# Altium project STM32.PrjPcb
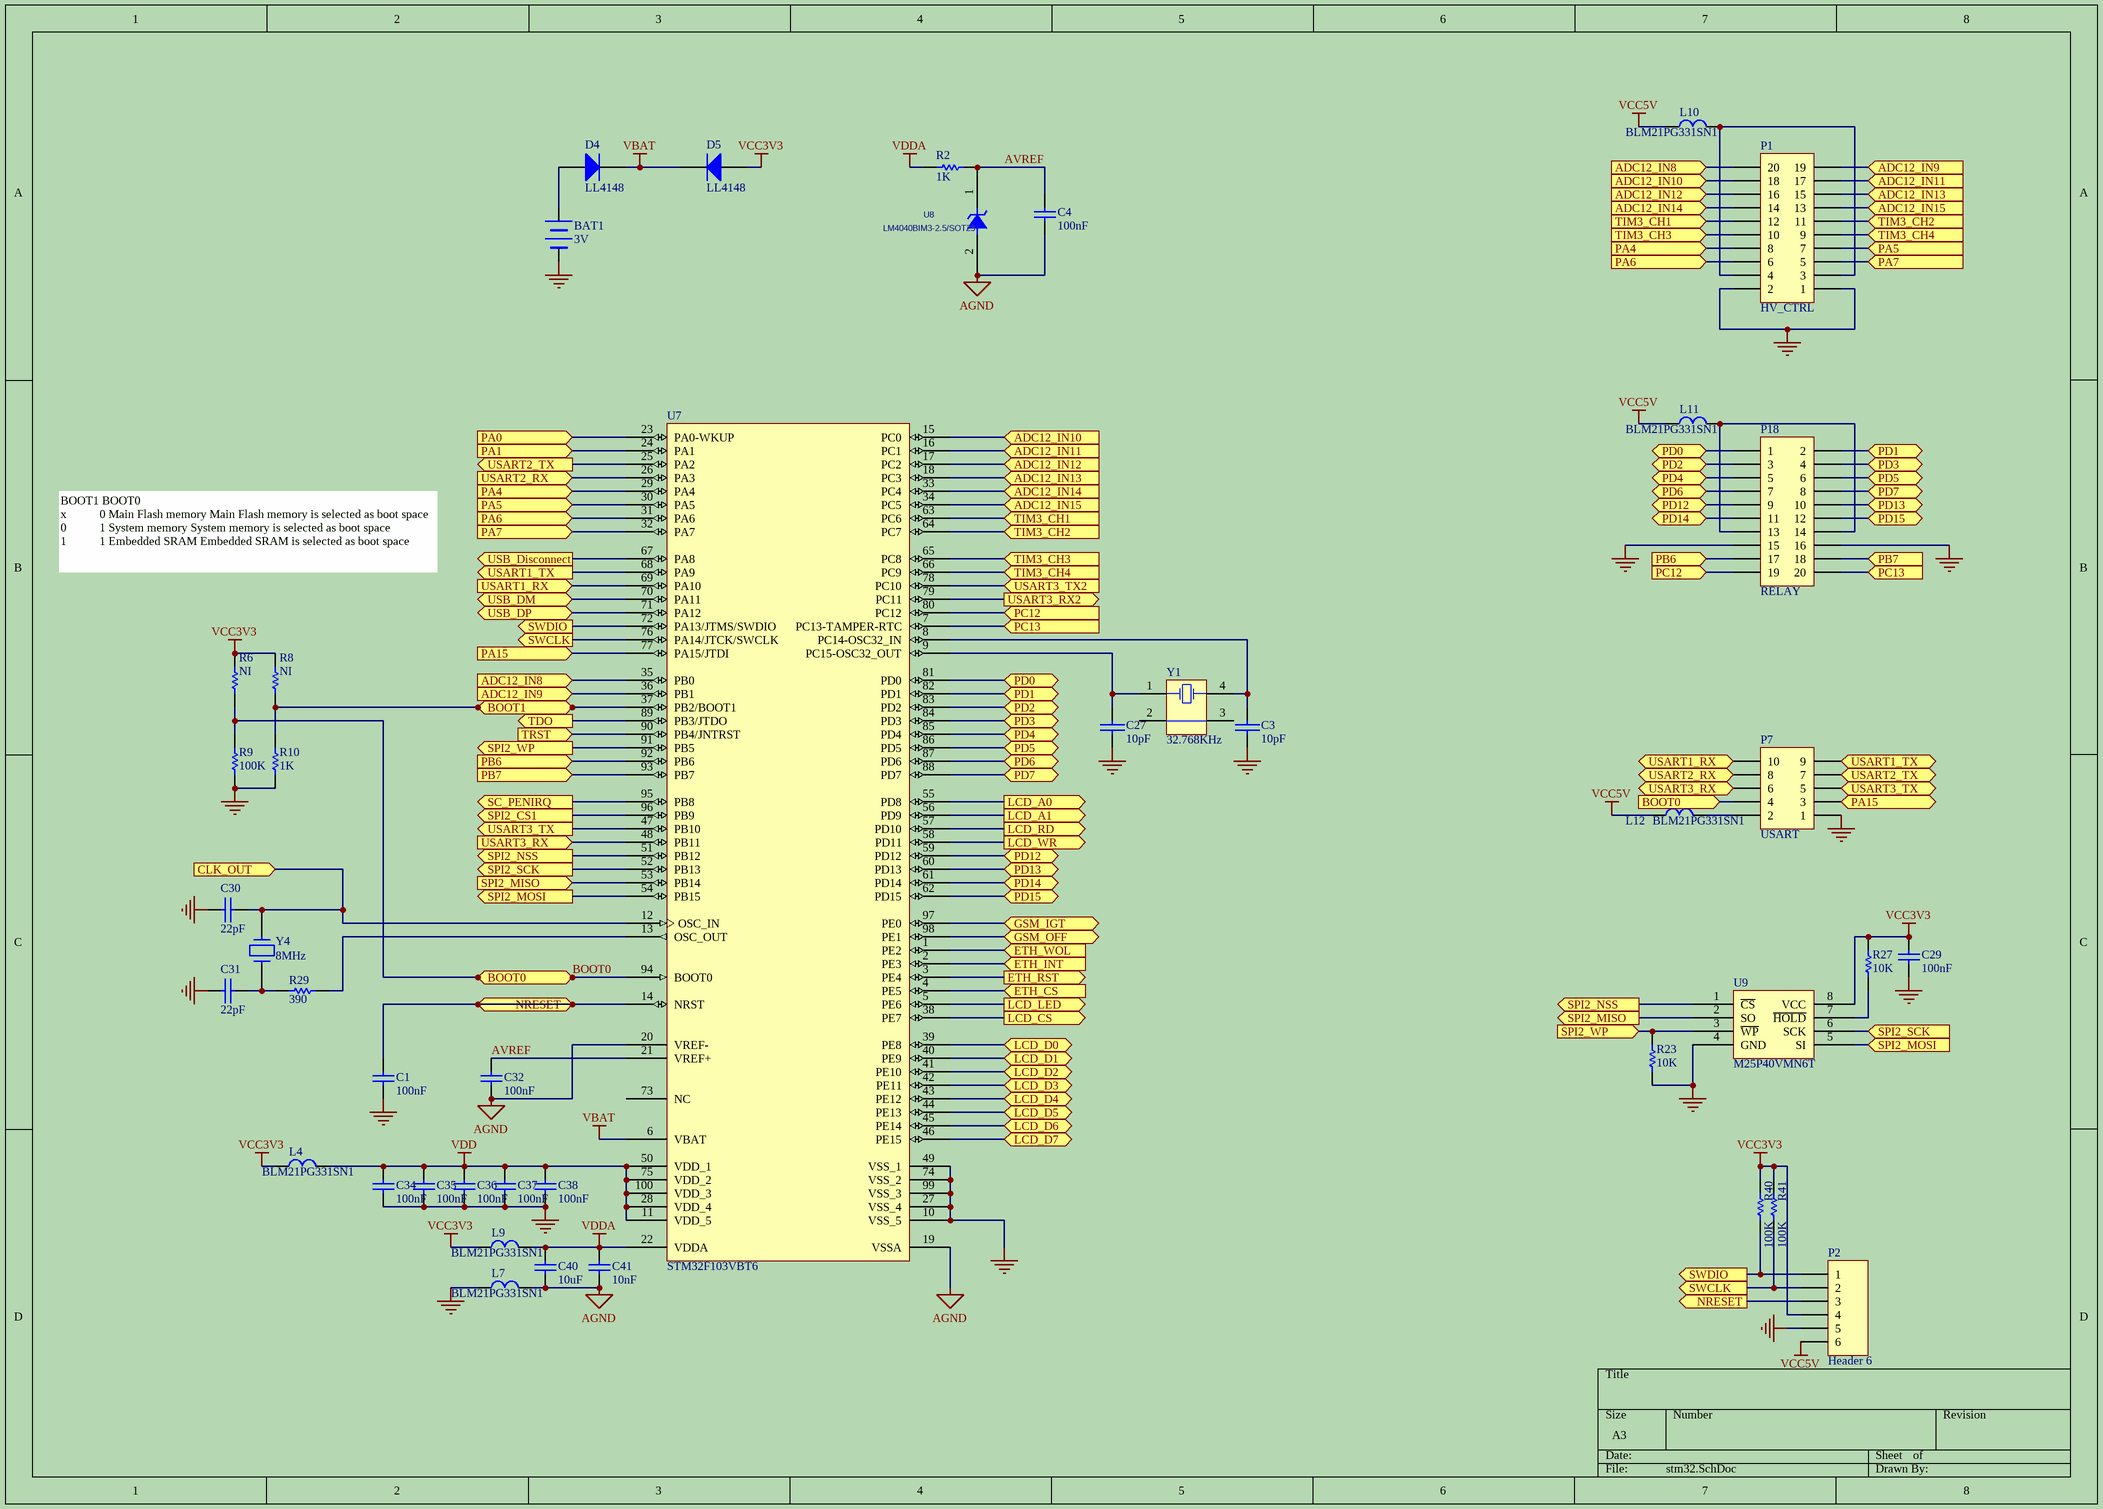
[diagram p0: stm32.SchDoc]
5 sheets, 146 parts. Net scope: flat (ports and power ports of the same name join across sheets).
Board file: MB.PcbDoc
Sheets:
  stm32.SchDoc
  EtherNet.SchDoc
  lcd_key_led.SchDoc
  POWER.SchDoc
  GSM.SchDoc

## Sheet stm32.SchDoc
size A3; PageSetup: Record=PageOptions|CenterHorizontal=True|CenterVertical=True|PrintScale=0.73|XCorrection=1.00|YCorrection=1.00|PrintKind=0|BorderSize=5000000|LeftOffset=0|BottomOffset=0|Orientation=2|PaperLength=1000|PaperWidth=1000|Scale=100|PaperSource=7|PrintQuality=600|MediaType=1|DitherType=10|PaperKind=A4|PrintScaleMode=1

### Parts
BAT1  3V  [battery]
C1  100nF  [C0805]
C3  10pF  [C0805]
C4  100nF  [C0805]
C27  10pF  [C0805]
C29  100nF  [C0805]
C30  22pF  [C0805]
C31  22pF  [C0805]
C32  100nF  [C0805]
C34  100nF  [C0805]
C35  100nF  [C0805]
C36  100nF  [C0805]
C37  100nF  [C0805]
C38  100nF  [C0805]
C40  10uF  [C1206]
C41  10nF  [C0805]
D4  LL4148  [D1206]
D5  LL4148  [D1206]
L4  BLM21PG331SN1  [L0805]
L7  BLM21PG331SN1  [L0805]
L9  BLM21PG331SN1  [L0805]
L10  BLM21PG331SN1  [L0805]
L11  BLM21PG331SN1  [L0805]
L12  BLM21PG331SN1  [L0805]
P1  HV_CTRL  [IDC20-EJ]
P2  Header 6  [TJC3-6A]
P7  USART  [IDC10-EJ]
P18  RELAY  [IDC20-EJ]
R2  1K  [R0805]
R6  NI  [R0805]
R8  NI  [R0805]
R9  100K  [R0805]
R10  1K  [R0805]
R23  10K  [R0805]
R27  10K  [R0805]
R29  390  [R0805]
R40  100K  [R0805]
R41  100K  [R0805]
U7  STM32F103VBT6  [LQFP100_N]
U8  LM4040BIM3-2.5/SOT23  [sot-23]
U9  M25P40VMN6T  [SO8]
Y1  32.768KHz  [DSO-N4]
Y4  8MHz  [CRYSTAL2]

### Ports
ADC12_IN8 (in), ADC12_IN9 (in), ADC12_IN10 (in), ADC12_IN11 (in), ADC12_IN12 (in), ADC12_IN13 (in), ADC12_IN14 (in), ADC12_IN15 (in), BOOT0 (in), BOOT1 (in), CLK_OUT (in), ETH_CS (in), ETH_INT (in), ETH_RST (out), ETH_WOL (in), GSM_IGT, GSM_OFF, LCD_A0 (out), LCD_A1 (out), LCD_CS (out), LCD_D0, LCD_D1, LCD_D2, LCD_D3, LCD_D4, LCD_D5, LCD_D6, LCD_D7, LCD_LED (out), LCD_RD (out), LCD_WR (out), NRESET (out), PA0 (in), PA1 (in), PA4 (in), PA5 (in), PA6 (in), PA7 (in), PA15 (in), PB6 (in), PB7 (in), PC12 (in), PC13 (in), PD0, PD1, PD2, PD3, PD4, PD5, PD6, PD7, PD12, PD13, PD14, PD15, SC_PENIRQ (out), SPI2_CS1 (out), SPI2_MISO (in), SPI2_MISO (out), SPI2_MOSI (in), SPI2_MOSI (out), SPI2_NSS (out), SPI2_SCK (in), SPI2_SCK (out), SPI2_WP (in), SPI2_WP (out), SWCLK (out), SWDIO (out), TDO (out), TIM3_CH1 (in), TIM3_CH2 (in), TIM3_CH3 (in), TIM3_CH4 (in), TRST (in), USART1_RX (in), USART1_TX (out), USART2_RX (in), USART2_TX (out), USART3_RX2 (out), USART3_RX (in), USART3_TX2 (in), USART3_TX (out), USB_Disconnect (out), USB_DM (bidir), USB_DP (bidir)

### Nets
AGND: C4.1 C32.1 C40.1 C41.1 L7.2 U7.19(VSSA) U7.20(VREF-) U8.2(A)
GND: BAT1.2 C1.1 C3.2 C27.2 C29.1 C30.2 C31.2 C34.1 C35.1 C36.1 C37.1 C38.1 L7.1 P1.1 P1.2 P2.5 P7.1 P18.15 P18.16 R9.2 R10.2 R23.2 U7.10(VSS_5) U7.27(VSS_4) U7.49(VSS_1) U7.74(VSS_2) U7.99(VSS_3) U9.4(GND)
VBAT: D4.2(K) D5.2(K) U7.6(VBAT)
VCC3V3: C29.2 D5.1(A) L4.1 L9.1 P2.4 R6.1 R8.1 R27.2 R40.2 R41.2 U9.8(VCC)
VCC5V: L10.1 L11.1 L12.1 P2.6
VDD: C34.2 C35.2 C36.2 C37.2 C38.2 L4.2 U7.11(VDD_5) U7.28(VDD_4) U7.50(VDD_1) U7.75(VDD_2) U7.100(VDD_3)
VDDA: C40.2 C41.2 L9.2 R2.1 U7.22(VDDA)
AVREF: C4.2 C32.2 R2.2 U7.21(VREF+) U8.1(K)
BOOT0: P7.4 R6.2 R9.1 U7.94(BOOT0) ; port BOOT0
ETH_CS: U7.4(PE5) ; port ETH_CS
ETH_INT: U7.2(PE3) ; port ETH_INT
ETH_RST: U7.3(PE4) ; port ETH_RST
ETH_WOL: U7.1(PE2) ; port ETH_WOL
SPI_MISO: U7.53(PB14) U9.2(SO) ; port SPI2_MISO
SPI_MOSI: U7.54(PB15) U9.5(SI) ; port SPI2_MOSI
SPI_SCK: U7.52(PB13) U9.6(SCK) ; port SPI2_SCK
NetBAT1_1: BAT1.1 D4.1(A)
NetC1_2: C1.2 P2.3 U7.14(NRST) ; port NRESET
NetC3_1: C3.1 U7.8(PC14-OSC32_IN) Y1.4(OSC2)
NetC27_1: C27.1 U7.9(PC15-OSC32_OUT) Y1.1(OSC1)
NetC30_1: C30.1 U7.12(OSC_IN) Y4.2 ; port CLK_OUT
NetC31_1: C31.1 R29.2 Y4.1
NetD6_1: R8.2 R10.1 U7.37(PB2/BOOT1) ; port BOOT1
NetL10_2: L10.2 P1.3 P1.4
NetL11_2: L11.2 P18.13 P18.14
NetL12_2: L12.2 P7.2
NetP1_5: P1.5 U7.32(PA7) ; port PA7
NetP1_6: P1.6 U7.31(PA6) ; port PA6
NetP1_7: P1.7 U7.30(PA5) ; port PA5
NetP1_8: P1.8 U7.29(PA4) ; port PA4
NetP1_9: P1.9 U7.66(PC9) ; port TIM3_CH4
NetP1_10: P1.10 U7.65(PC8) ; port TIM3_CH3
NetP1_11: P1.11 U7.64(PC7) ; port TIM3_CH2
NetP1_12: P1.12 U7.63(PC6) ; port TIM3_CH1
NetP1_13: P1.13 U7.34(PC5) ; port ADC12_IN15
NetP1_14: P1.14 U7.33(PC4) ; port ADC12_IN14
NetP1_15: P1.15 U7.18(PC3) ; port ADC12_IN13
NetP1_16: P1.16 U7.17(PC2) ; port ADC12_IN12
NetP1_17: P1.17 U7.16(PC1) ; port ADC12_IN11
NetP1_18: P1.18 U7.15(PC0) ; port ADC12_IN10
NetP1_19: P1.19 U7.36(PB1) ; port ADC12_IN9
NetP1_20: P1.20 U7.35(PB0) ; port ADC12_IN8
NetP2_1: P2.1 R40.1 U7.72(PA13/JTMS/SWDIO) ; port SWDIO
NetP2_2: P2.2 R41.1 U7.76(PA14/JTCK/SWCLK) ; port SWCLK
NetP3_3: U7.39(PE8) ; port LCD_D0
NetP3_4: U7.55(PD8) ; port LCD_A0
NetP3_5: U7.40(PE9) ; port LCD_D1
NetP3_6: U7.56(PD9) ; port LCD_A1
NetP3_7: U7.41(PE10) ; port LCD_D2
NetP3_8: U7.38(PE7) ; port LCD_CS
NetP3_9: U7.42(PE11) ; port LCD_D3
NetP3_11: U7.43(PE12) ; port LCD_D4
NetP3_13: U7.44(PE13) ; port LCD_D5
NetP3_15: U7.45(PE14) ; port LCD_D6
NetP3_17: U7.46(PE15) ; port LCD_D7
NetP3_18: U7.57(PD10) ; port LCD_RD
NetP3_19: U7.58(PD11) ; port LCD_WR
NetP3_20: U7.5(PE6) ; port LCD_LED
NetP3_29: U7.23(PA0-WKUP) ; port PA0
NetP3_30: U7.24(PA1) ; port PA1
NetP7_3: P7.3 U7.77(PA15/JTDI) ; port PA15
NetP7_5: P7.5 U7.47(PB10) ; port USART3_TX
NetP7_6: P7.6 U7.48(PB11) ; port USART3_RX
NetP7_7: P7.7 U7.25(PA2) ; port USART2_TX
NetP7_8: P7.8 U7.26(PA3) ; port USART2_RX
NetP7_9: P7.9 U7.68(PA9) ; port USART1_TX
NetP7_10: P7.10 U7.69(PA10) ; port USART1_RX
NetP18_1: P18.1 U7.81(PD0) ; port PD0
NetP18_2: P18.2 U7.82(PD1) ; port PD1
NetP18_3: P18.3 U7.83(PD2) ; port PD2
NetP18_4: P18.4 U7.84(PD3) ; port PD3
NetP18_5: P18.5 U7.85(PD4) ; port PD4
NetP18_6: P18.6 U7.86(PD5) ; port PD5
NetP18_7: P18.7 U7.87(PD6) ; port PD6
NetP18_8: P18.8 U7.88(PD7) ; port PD7
NetP18_9: P18.9 U7.59(PD12) ; port PD12
NetP18_10: P18.10 U7.60(PD13) ; port PD13
NetP18_11: P18.11 U7.61(PD14) ; port PD14
NetP18_12: P18.12 U7.62(PD15) ; port PD15
NetP18_17: P18.17 U7.92(PB6) ; port PB6
NetP18_18: P18.18 U7.93(PB7) ; port PB7
NetP18_19: P18.19 U7.80(PC12) ; port PC12
NetP18_20: P18.20 U7.7(PC13-TAMPER-RTC) ; port PC13
NetR3_1: U7.70(PA11) ; port USB_DM
NetR5_1: U7.71(PA12) ; port USB_DP
NetR13_1: U7.67(PA8) ; port USB_Disconnect
NetR21_1: U7.95(PB8) ; port SC_PENIRQ
NetR23_1: R23.1 U7.91(PB5) U9.3(~{WP}) ; port SPI2_WP
NetR27_1: R27.1 U9.7(~{HOLD})
NetR29_1: R29.1 U7.13(OSC_OUT)
NetR64_1: U7.97(PE0) ; port GSM_IGT
NetR68_1: U7.98(PE1) ; port GSM_OFF
NetU3_15: U7.78(PC10) ; port USART3_TX2
NetU3_17: U7.79(PC11) ; port USART3_RX2
NetU5_15: U7.96(PB9) ; port SPI2_CS1
NetU7_51: U7.51(PB12) U9.1(~{CS}) ; port SPI2_NSS
NetU7_89: U7.89(PB3/JTDO) ; port TDO
NetU7_90: U7.90(PB4/JNTRST) ; port TRST

Not connected (* = marked no-connect by the designer): U7 73(NC); Y1 2(COM) 3(COM)

### Notes on the sheet
- BOOT1 BOOT0
  x           0 Main Flash memory Main Flash memory is selected as boot space
  0           1 System memory System memory is selected as boot space
  1           1 Embedded SRAM Embedded SRAM is selected as boot space

### Library data of the parts
BAT1 = BATTERY
C1 C32 C34-C38 C40 C41 = CAP: Capacitor; Value: 100pF; Published: 8-Jun-2000; Revision: July-2002: Re-released for DXP Platform.; Publisher: Altium Limited
C3 C27 C30 C31 = CAP: Capacitor
C4 C29 = Cap: Capacitor; Value: 100pF; Published: 8-Jun-2000; LatestRevisionDate: 17-Jul-2002; LatestRevisionNote: Re-released for DXP Platform.; PackageReference: RAD-0.3; Publisher: Altium Limited
D4 D5 = Diode: Default Diode; Published: 8-Jun-2000; LatestRevisionDate: 17-Jul-2002; LatestRevisionNote: Re-released for DXP Platform.; PackageVersion: Sep-1996; PackageReference: SMC; Publisher: Altium Limited; Code_JEDEC: DO-214-AB
L4 L7 L9-L12 = L1
P1 P18 = Header 10X2: Header, 10-Pin, Dual row; LatestRevisionDate: 17-Jul-2002; LatestRevisionNote: Re-released for DXP Platform.; Publisher: Altium Limited
P2 = Header 6: Header, 6-Pin; LatestRevisionDate: 17-Jul-2002; LatestRevisionNote: Re-released for DXP Platform.; Publisher: Altium Limited
P7 = Header 5X2: Header, 5-Pin, Dual row; LatestRevisionDate: 17-Jul-2002; LatestRevisionNote: Re-released for DXP Platform.; Publisher: Altium Limited
R2 R10 = res1: Resistor; Published: 8-Jun-2000; Revision: July-2002: Re-released for DXP Platform.; Publisher: Altium Limited; Value: 1K
R6 R8 R9 R23 = res1: Resistor; Value: 1K; Published: 8-Jun-2000; Revision: July-2002: Re-released for DXP Platform.; Publisher: Altium Limited
R27 R29 R40 R41 = Res1: Resistor; Value: 1K; Published: 8-Jun-2000; Publisher: Altium Limited
  R27 R40 R41: LatestRevisionDate: 17-Jul-2002; LatestRevisionNote: Re-released for DXP Platform.; PackageReference: AXIAL-0.3
  R29: Revision: July-2002: Re-released for DXP Platform.
U7 = STM32F103VBT6: STM32 ARM-based 32-bit MCU with 64 Kbytes Flash, 100-pin LQFP, Industrial Temperature; Published: *; DatasheetVersion: *; PackageVersion: *; PackageReference: *; Publisher: *; PackageDescription: *; ComponentLink1Description: *; ComponentLink1URL: *; ComponentLink2Description: *; ComponentLink2URL: *
U8 = LM4040/SOT23
U9 = SPI_FLASH
Y1 = ECS-35-17-7S: Crystal Oscillator; Published: 17-Jul-2002; DatasheetDocument: 18-Apr-2000; PackageReference: ECX-3S; Publisher: Altium Limited; ComponentLink1Description: Manufacturer Link; ComponentLink1URL: http://www.ecsxtal.com/; ComponentLink2Description: Datasheet; ComponentLink2URL: http://www.ecsxtal.com/pdf/ecx-3s.pdf
Y4 = CRYSTAL

## Sheet EtherNet.SchDoc
size A4
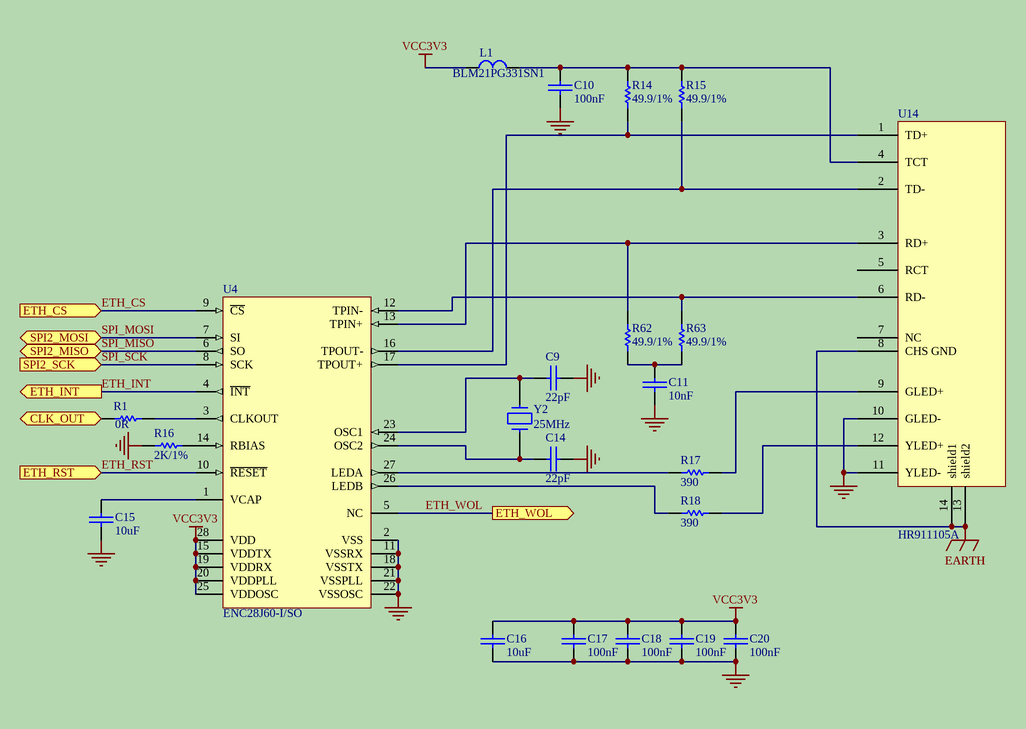
[diagram p1: EtherNet.SchDoc]

### Parts
C9  22pF  [C0805]
C10  100nF  [C0805]
C11  10nF  [C0805]
C14  22pF  [C0805]
C15  10uF  [C1206]
C16  10uF  [C1206]
C17  100nF  [C0805]
C18  100nF  [C0805]
C19  100nF  [C0805]
C20  100nF  [C0805]
L1  BLM21PG331SN1  [L0805]
R1  0R  [R0805]
R14  49.9/1%  [R0805]
R15  49.9/1%  [R0805]
R16  2K/1%  [R0805]
R17  390  [R0805]
R18  390  [R0805]
R62  49.9/1%  [R0805]
R63  49.9/1%  [R0805]
U4  ENC28J60-I/SO  [SOIC-SO28_L]
U14  HR911105A  [HANRUN-A8]
Y2  25MHz  [CRYSTAL2]

### Ports
CLK_OUT (in), ETH_CS (in), ETH_INT (out), ETH_RST (in), ETH_WOL (out), SPI2_MISO, SPI2_MOSI, SPI2_SCK (in)

### Nets
EARTH: U14.8(CHS_GND) U14.13(shield2) U14.14(shield1)
GND: C9.2 C10.1 C11.1 C14.2 C15.1 C16.1 C17.1 C18.1 C19.1 C20.1 R16.1 U4.2(VSS) U4.11(VSSRX) U4.18(VSSTX) U4.21(VSSPLL) U4.22(VSSOSC) U14.10(GLED-) U14.11(YLED-)
VCC3V3: C16.2 C17.2 C18.2 C19.2 C20.2 L1.1 U4.15(VDDTX) U4.19(VDDRX) U4.20(VDDPLL) U4.25(VDDOSC) U4.28(VDD)
ETH_CS: U4.9(~{CS}) ; port ETH_CS
ETH_INT: U4.4(~{INT}) ; port ETH_INT
ETH_RST: U4.10(~{RESET}) ; port ETH_RST
ETH_WOL: U4.5(NC) ; port ETH_WOL
SPI_MISO: U4.6(SO) ; port SPI2_MISO
SPI_MOSI: U4.7(SI) ; port SPI2_MOSI
SPI_SCK: U4.8(SCK) ; port SPI2_SCK
NetC9_1: C9.1 U4.23(OSC1) Y2.1
NetC10_2: C10.2 L1.2 R14.1 R15.1 U14.4(TCT)
NetC11_2: C11.2 R62.1 R63.1
NetC14_1: C14.1 U4.24(OSC2) Y2.2
NetC15_2: C15.2 U4.1(VCAP)
NetC30_1: R1.1 ; port CLK_OUT
NetR1_2: R1.2 U4.3(CLKOUT)
NetR14_2: R14.2 U4.17(TPOUT+) U14.1(TD+)
NetR15_2: R15.2 U4.16(TPOUT-) U14.2(TD-)
NetR16_2: R16.2 U4.14(RBIAS)
NetR17_1: R17.1 U14.9(GLED+)
NetR17_2: R17.2 U4.27(LEDA)
NetR18_1: R18.1 U14.12(YLED+)
NetR18_2: R18.2 U4.26(LEDB)
NetR62_2: R62.2 U4.13(TPIN+) U14.3(RD+)
NetR63_2: R63.2 U4.12(TPIN-) U14.6(RD-)

Not connected (* = marked no-connect by the designer): U14 5(RCT) 7(NC)

### Library data of the parts
C9-C11 C14-C20 = CAP: Capacitor
L1 = L1
R1 R14-R18 R62 R63 = Res1: Resistor; Value: 1K; Published: 8-Jun-2000; LatestRevisionDate: 17-Jul-2002; LatestRevisionNote: Re-released for DXP Platform.; PackageReference: AXIAL-0.3; Publisher: Altium Limited
U4 = ENC28J60/SO: Stand-Alone Ethernet Controller with SPI Interface, 28-Pin SOIC; Published: 29-Jan-2009; DatasheetVersion: RevC, Jan-2008; PackageVersion: revAW, Oct-2008; PackageReference: SOIC-SO28; Publisher: Altium Limited; PackageDescription: 28-Lead Plastic Small Outline (SO) - Wide 7.50mm Body [SOIC]; Code_JEDEC: MS-013; ComponentLink1Description: Manufacturer Link; ComponentLink1URL: http://www.microchip.com; ComponentLink2Description: Datasheet; ComponentLink2URL: http://ww1.microchip.com/downloads/en/DeviceDoc/39662c.pdf; ComponentLink3Description: Packaging Specification; ComponentLink3URL: http://ww1.microchip.com/downloads/en/PackagingSpec/00049AW.pdf
U14 = HR911105A: RJ45 Connector with Integrated Magnetics; Text Field1: 80; Text Field2: 270
Y2 = CRYSTAL

## Sheet lcd_key_led.SchDoc
size A4; PageSetup: Record=PageOptions|CenterHorizontal=True|CenterVertical=True|PrintScale=1.04|XCorrection=1.00|YCorrection=1.00|PrintKind=0|BorderSize=5000000|LeftOffset=0|BottomOffset=0|Orientation=2|PaperLength=1000|PaperWidth=1000|Scale=100|PaperSource=7|PrintQuality=-4|MediaType=1|DitherType=10|PaperKind=A3|PrintScaleMode=1
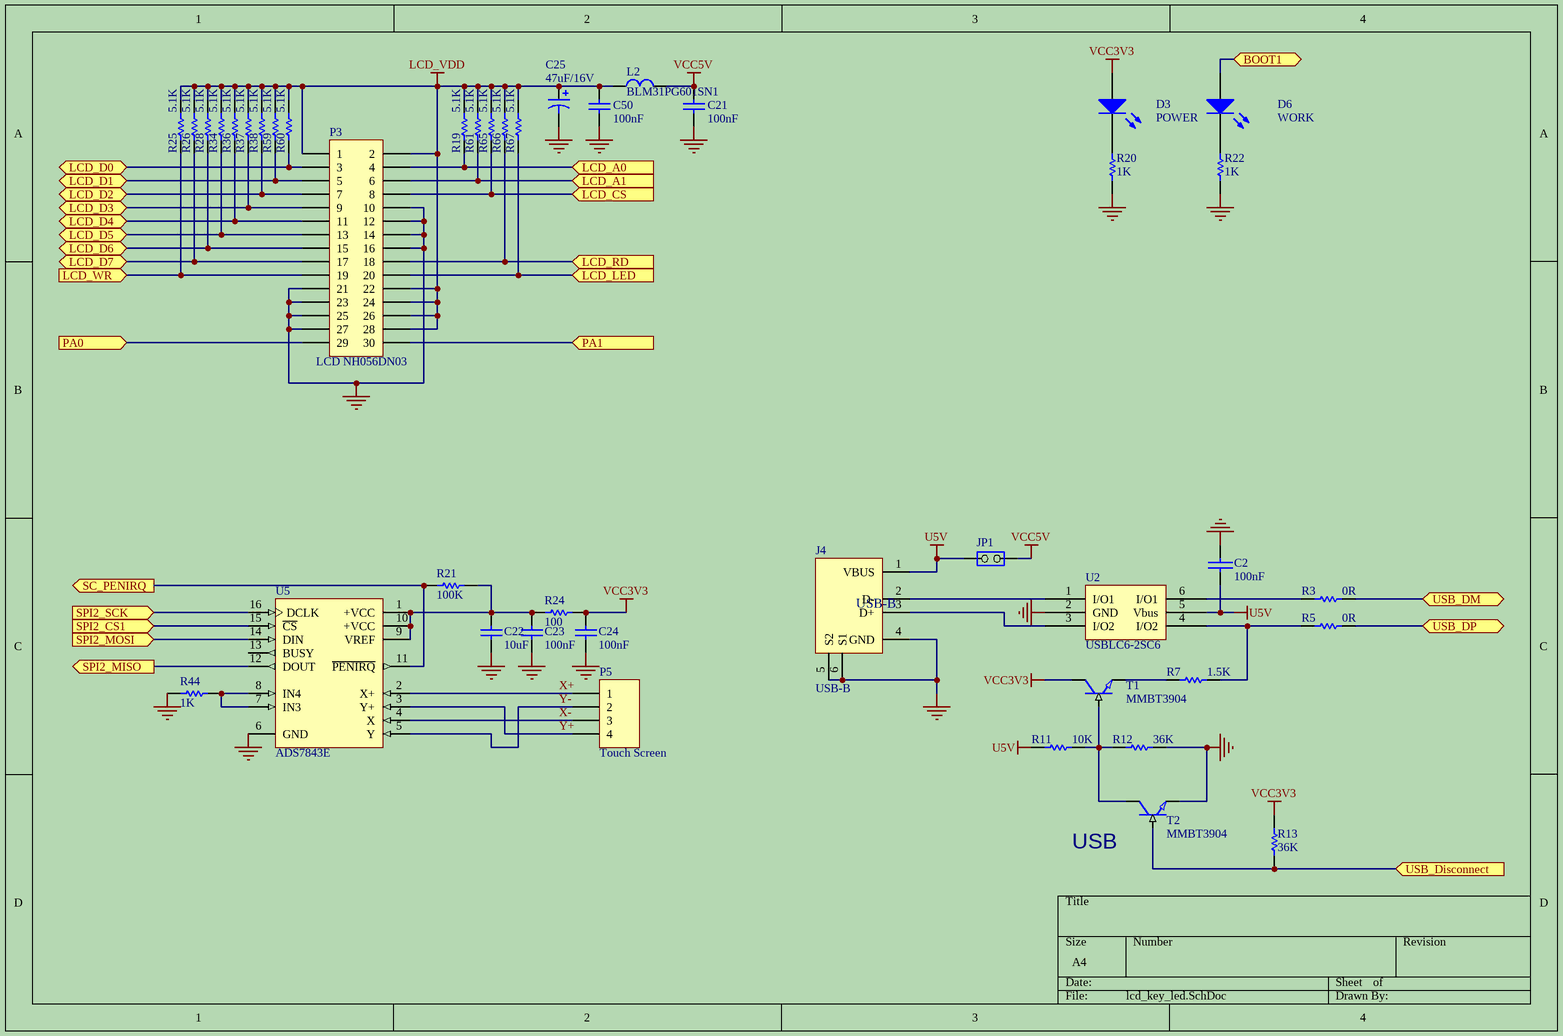
[diagram p2: lcd_key_led.SchDoc]

### Parts
C2  100nF  [C0805]
C21  100nF  [C0805]
C22  10uF  [C1206]
C23  100nF  [C0805]
C24  100nF  [C0805]
C25  47uF/16V  [CD1/2]
C50  100nF  [C0805]
D3  POWER  [LED0805]
D6  WORK  [LED0805]
J4  USB-B  [USB-B]
JP1  (no value)  [SIP2]
L2  BLM31PG601SN1  [l1206]
P3  LCD NH056DN03  [HDR2X15]
P5  Touch Screen  [TJC3-4A]
R3  0R  [R0805]
R5  0R  [R0805]
R7  1.5K  [R0805]
R11  10K  [R0805]
R12  36K  [R0805]
R13  36K  [R0805]
R19  5.1K  [R0805]
R20  1K  [R0805]
R21  100K  [R0805]
R22  1K  [R0805]
R24  100  [R0805]
R25  5.1K  [R0805]
R26  5.1K  [R0805]
R28  5.1K  [R0805]
R34  5.1K  [R0805]
R36  5.1K  [R0805]
R37  5.1K  [R0805]
R38  5.1K  [R0805]
R44  1K  [R0805]
R59  5.1K  [R0805]
R60  5.1K  [R0805]
R61  5.1K  [R0805]
R65  5.1K  [R0805]
R66  5.1K  [R0805]
R67  5.1K  [R0805]
T1  MMBT3904  [SOT-23]
T2  MMBT3904  [SOT-23]
U2  USBLC6-2SC6  [SOT-23/6]
U5  ADS7843E  [DBQ016]

### Ports
BOOT1, LCD_A0 (in), LCD_A1 (in), LCD_CS (in), LCD_D0, LCD_D1, LCD_D2, LCD_D3, LCD_D4, LCD_D5, LCD_D6, LCD_D7, LCD_LED (in), LCD_RD (in), LCD_WR (in), PA0 (in), PA1 (in), SC_PENIRQ (out), SPI2_CS1 (in), SPI2_MISO (out), SPI2_MOSI (in), SPI2_SCK (in), USB_Disconnect (in), USB_DM (bidir), USB_DP (bidir)

### Nets
GND: C2.1 C21.1 C22.1 C23.1 C24.1 C25.2 C50.1 J4.4(GND) J4.5(S2) J4.6(S1) P3.10 P3.12 P3.14 P3.16 P3.21 P3.23 P3.25 P3.27 R12.1 R20.2 R22.2 R44.1 T2.2(E) U2.2(GND) U5.6(GND)
LCD_VDD: C25.1 C50.2 L2.1 P3.1 P3.2 P3.22 P3.24 P3.26 P3.28 R19.1 R25.1 R26.1 R28.1 R34.1 R36.1 R37.1 R38.1 R59.1 R60.1 R61.1 R65.1 R66.1 R67.1
U5V: C2.2 J4.1(VBUS) JP1.2(NO) R11.2 U2.5(Vbus)
VCC3V3: C24.2 D3.1(A) R13.2 R24.2 T1.3(C)
VCC5V: C21.2 JP1.1(COMMON) L2.2
SPI_MISO: U5.12(DOUT) ; port SPI2_MISO
SPI_MOSI: U5.14(DIN) ; port SPI2_MOSI
SPI_SCK: U5.16(DCLK) ; port SPI2_SCK
X+: P5.1 U5.2(X+)
X-: P5.3 U5.4(X)
Y+: P5.4 U5.3(Y+)
Y-: P5.2 U5.5(Y)
NetC22_2: C22.2 C23.2 R21.2 R24.1 U5.1(+VCC) U5.9(VREF) U5.10(+VCC)
NetD3_2: D3.2(K) R20.1
NetD6_1: D6.1(A) ; port BOOT1
NetD6_2: D6.2(K) R22.1
NetJ4_2: J4.2(D-) U2.1(I/O1)
NetJ4_3: J4.3(D+) U2.3(I/O2)
NetP3_3: P3.3 R60.2 ; port LCD_D0
NetP3_4: P3.4 R19.2 ; port LCD_A0
NetP3_5: P3.5 R59.2 ; port LCD_D1
NetP3_6: P3.6 R61.2 ; port LCD_A1
NetP3_7: P3.7 R38.2 ; port LCD_D2
NetP3_8: P3.8 R65.2 ; port LCD_CS
NetP3_9: P3.9 R37.2 ; port LCD_D3
NetP3_11: P3.11 R36.2 ; port LCD_D4
NetP3_13: P3.13 R34.2 ; port LCD_D5
NetP3_15: P3.15 R28.2 ; port LCD_D6
NetP3_17: P3.17 R26.2 ; port LCD_D7
NetP3_18: P3.18 R66.2 ; port LCD_RD
NetP3_19: P3.19 R25.2 ; port LCD_WR
NetP3_20: P3.20 R67.2 ; port LCD_LED
NetP3_29: P3.29 ; port PA0
NetP3_30: P3.30 ; port PA1
NetR3_1: R3.1 ; port USB_DM
NetR3_2: R3.2 U2.6(I/O1)
NetR5_1: R5.1 ; port USB_DP
NetR5_2: R5.2 R7.1 U2.4(I/O2)
NetR7_2: R7.2 T1.2(E)
NetR11_1: R11.1 R12.2 T1.1(B) T2.3(C)
NetR13_1: R13.1 T2.1(B) ; port USB_Disconnect
NetR21_1: R21.1 U5.11(~{PENIRQ}) ; port SC_PENIRQ
NetR44_2: R44.2 U5.7(IN3) U5.8(IN4)
NetU5_15: U5.15(~{CS}) ; port SPI2_CS1

Not connected (* = marked no-connect by the designer): U5 13(BUSY)

### Notes on the sheet
- (near T2) USB

### Library data of the parts
C2 = CAP: Capacitor
C21-C24 C50 = CAP: Capacitor; Value: 100pF; Published: 8-Jun-2000; Revision: July-2002: Re-released for DXP Platform.; Publisher: Altium Limited
C25 = Cap Pol1: Polarized Capacitor (Radial); Value: 100pF; Published: 8-Jun-2000; LatestRevisionDate: 17-Jul-2002; LatestRevisionNote: Re-released for DXP Platform.; PackageReference: RB7.6-15; Publisher: Altium Limited
D3 D6 = LED0: Typical INFRARED GaAs LED; Published: 8-Jun-2000; LatestRevisionDate: 08-Jul-2005; LatestRevisionNote: Mech Layer 1 removed.; PackageReference: LED-0; Publisher: Altium Limited
JP1 = JP2
L2 = L1
P3 = Header 15X2: Header, 15-Pin, Dual row; LatestRevisionDate: 17-Jul-2002; LatestRevisionNote: Re-released for DXP Platform.; Publisher: Altium Limited
P5 = Header 4: Header, 4-Pin; LatestRevisionDate: 17-Jul-2002; LatestRevisionNote: Re-released for DXP Platform.; Publisher: Altium Limited
R3 R5 R7 R11-R13 R19 R21 R24-R26 R28 R34 R36-R38 R59-R61 R65-R67 = Res1: Resistor; Value: 1K; Published: 8-Jun-2000; Publisher: Altium Limited
  R3 R5 R7 R11-R13: Revision: July-2002: Re-released for DXP Platform.
  R19 R21 R24-R26 R28 R34 R36-R38 R59-R61 R65-R67: LatestRevisionDate: 17-Jul-2002; LatestRevisionNote: Re-released for DXP Platform.; PackageReference: AXIAL-0.3
R20 R22 R44 = Res1: Resistor; Published: 8-Jun-2000; LatestRevisionDate: 17-Jul-2002; LatestRevisionNote: Re-released for DXP Platform.; PackageReference: AXIAL-0.3; Publisher: Altium Limited; Value: 1K
T1 T2 = NPN_SOT23: Text Field1: 22; Text Field2: 22
U2 = USBLC6-2
U5 = ADS7843E: 4-Wire Touch Screen Controller, 16-Pin SSOP, Pb-Free; Published: 6-Oct-2005; DatasheetVersion: May-2002; PackageVersion: Feb-2005; PackageReference: DBQ016; Publisher: Altium Limited; PackageDescription: SSOP; 16 Leads; Body Width 3.9 mm; Pitch 0.635 mm; Code_JEDEC: MO-137-AB; ComponentLink1Description: Manufacturer Link; ComponentLink1URL: http://focus.ti.com/docs/prod/folders/print/ads7843.html; ComponentLink2Description: Datasheet; ComponentLink2URL: http://focus.ti.com/lit/ds/symlink/ads7843.pdf

## Sheet POWER.SchDoc
size A4
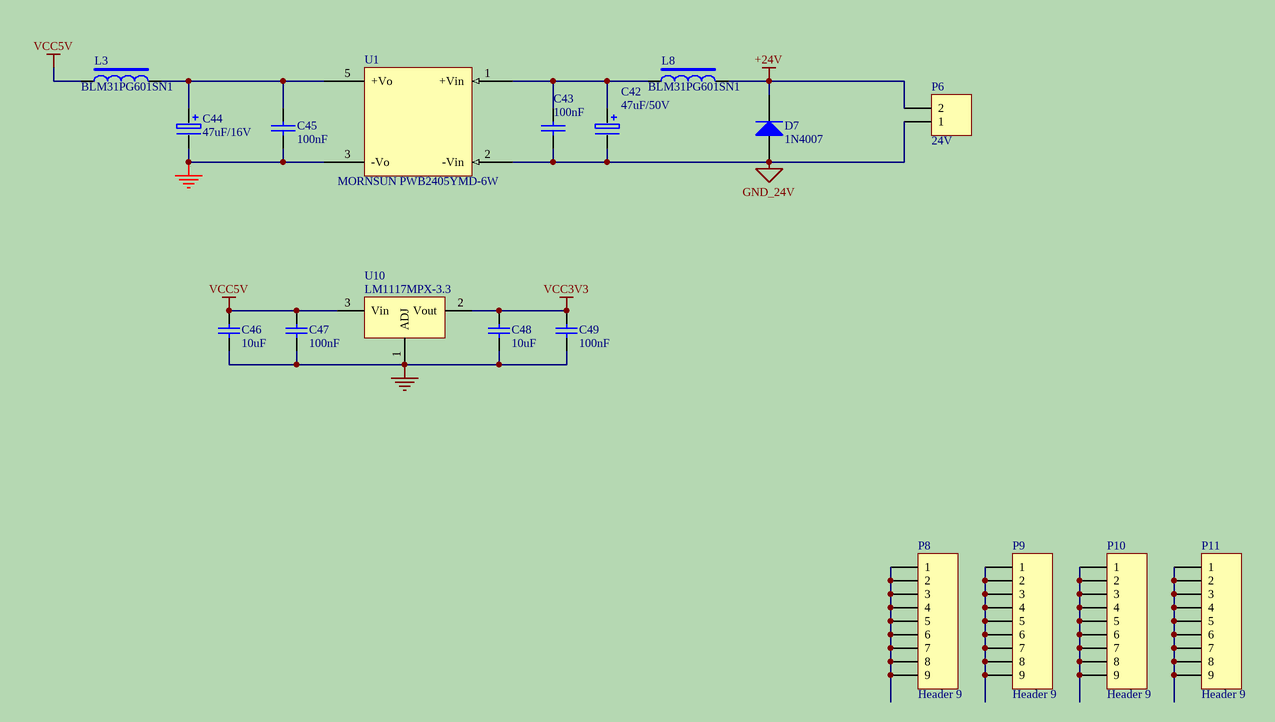
[diagram p3: POWER.SchDoc]

### Parts
C42  47uF/50V  [CD1/2]
C43  100nF  [C0805]
C44  47uF/16V  [CD1/2]
C45  100nF  [C0805]
C46  10uF  [C1206]
C47  100nF  [C0805]
C48  10uF  [C1206]
C49  100nF  [C0805]
D7  1N4007  [DO-41]
L3  BLM31PG601SN1  [L1206]
L8  BLM31PG601SN1  [L1206]
P6  24V  [3.96-2]
P8  Header 9  [lk]
P9  Header 9  [lk]
P10  Header 9  [lk]
P11  Header 9  [lk]
U1  MORNSUN PWB2405YMD-6W  [DC/DC-1X1]
U10  LM1117MPX-3.3  [SOT-223]

### Nets
+24V: D7.2(K) L8.2 P6.2
GND: C44.2 C45.2 C46.1 C47.1 C48.1 C49.1 U1.3(-Vo) U10.1(ADJ)
GND_24V: C42.2 C43.2 D7.1(A) P6.1 U1.2(-Vin)
NC: U1.4(NC)
VCC3V3: C48.2 C49.2 U10.2(Vout)
VCC5V: C46.2 C47.2 L3.1 U10.3(Vin)
NetC42_1: C42.1 C43.1 L8.1 U1.1(+Vin)
NetC44_1: C44.1 C45.1 L3.2 U1.5(+Vo)
NetP8_1: P8.1 P8.2 P8.3 P8.4 P8.5 P8.6 P8.7 P8.8 P8.9
NetP9_1: P9.1 P9.2 P9.3 P9.4 P9.5 P9.6 P9.7 P9.8 P9.9
NetP10_1: P10.1 P10.2 P10.3 P10.4 P10.5 P10.6 P10.7 P10.8 P10.9
NetP11_1: P11.1 P11.2 P11.3 P11.4 P11.5 P11.6 P11.7 P11.8 P11.9

### Library data of the parts
C42 C44 = CD1: Electrolytic Capacitor; Text Field1: 4.7uF:4V-A;6.3V-A;10V-A;16V-BA;20V-BA;25V-CB;35V-DC;50V-D;; Text Field2: 10uF:4V-AB;6.3V-BA;10V-BA;16V-CBA;20V-CB;25V-DC;35V-D;; Text Field3: 22uF:4V-BA;6.3V-CBA;10V-CB;16V-DBC;20V-DC;25V-D;35V-D;; Text Field4: 33uF:4V-CAB;6.3V-CBA;10V-DBC;16V-DCB;20V-DC;25V-DE;; Text Field5: 47uF:4V-CBA;6.3V-DBC;10V-DBC;16V-DC;20V-DE;; Text Field6: 68uF:4V-DBC;6.3V-DCB;10V-DCB;16V-D;20V-DE;; Text Field7: 100uF:4V-DCB;6.3V-EDBC;10V-DC;16V-DE;20V-E;; Text Field8: 220uF:4V-EDC;6.3V-ED;10V-ED;
C43 C45 = CC: Capacitor
C46-C49 = CAP: Capacitor; Value: 100pF; Published: 8-Jun-2000; Revision: July-2002: Re-released for DXP Platform.; Publisher: Altium Limited
D7 = Diode 1N4007: 1 Amp General Purpose Rectifier; Published: 8-Jun-2000; LatestRevisionDate: 17-Jul-2002; LatestRevisionNote: Re-released for DXP Platform.; DatasheetVersion: 1998; PackageVersion: Aug-1999; PackageReference: DO-41; Publisher: Altium Limited; PackageDescription: Diode, Axial; Body 5.2 x 2.7 mm (LxDia. max), Lead Dia. 0.86 mm (max); Code_JEDEC: DO-204-AL; ComponentLink1Description: Manufacturer Link; ComponentLink1URL: http://www.fairchildsemi.com/; ComponentLink2Description: Datasheet; ComponentLink2URL: http://www.fairchildsemi.com/ds/1N%2F1N4001.pdf
L3 L8 = INDUCTOR2
P6 = Header 2: Header, 2-Pin; LatestRevisionDate: 17-Jul-2002; LatestRevisionNote: Re-released for DXP Platform.; Publisher: Altium Limited
P8-P11 = Header 9: Header, 9-Pin; LatestRevisionDate: 17-Jul-2002; LatestRevisionNote: Re-released for DXP Platform.; Publisher: Altium Limited
U1 = 48S5: Text Field1: 80; Text Field2: 80
U10 = LM1117: 3-Terminal Adjustable Positive Voltage Regulator

## Sheet GSM.SchDoc
size A3
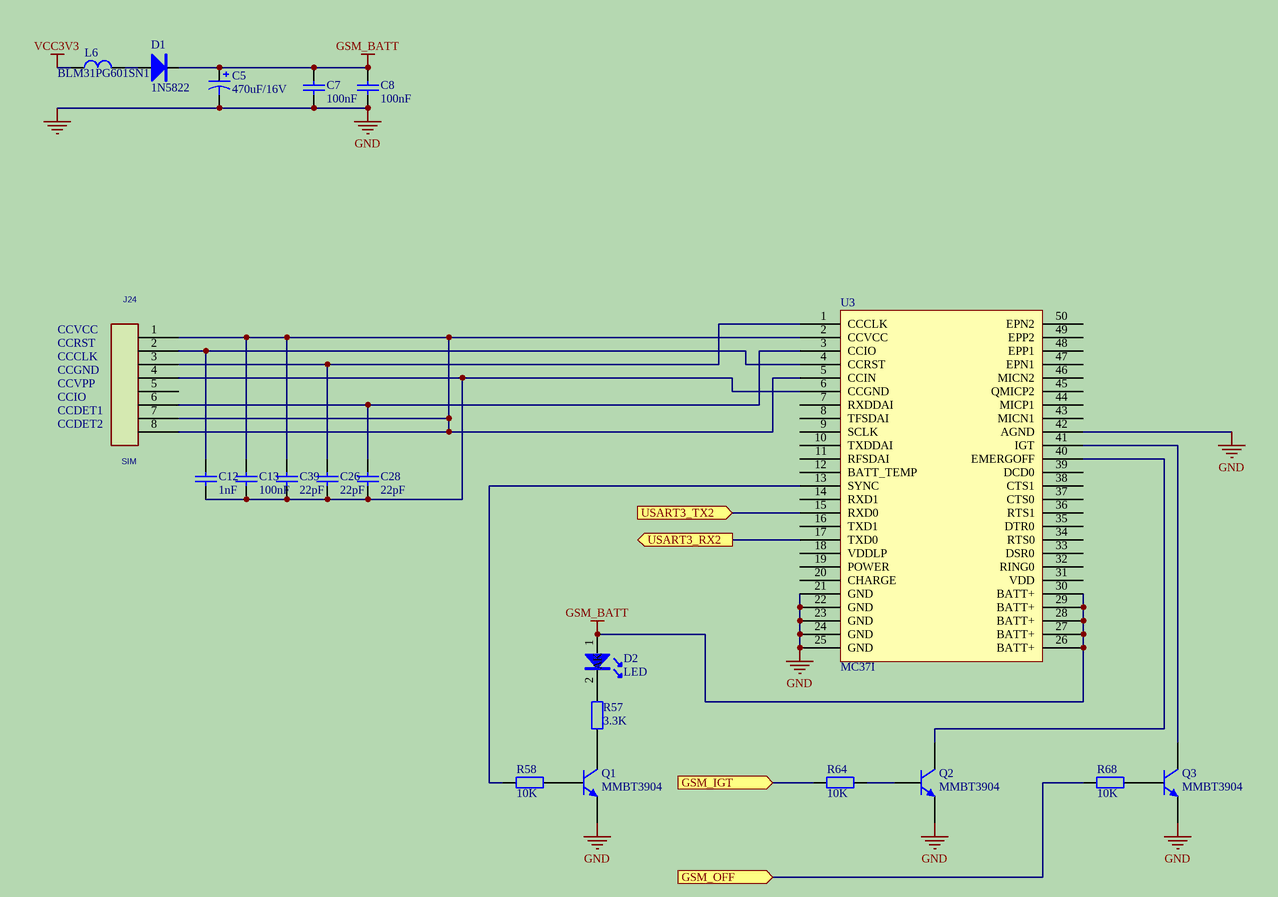
[diagram p4: GSM.SchDoc]

### Parts
C5  470uF/16V  [CD2/3]
C7  100nF  [C0805]
C8  100nF  [C0805]
C12  1nF  [C0805]
C13  100nF  [C0805]
C26  22pF  [C0805]
C28  22pF  [C0805]
C39  22pF  [C0805]
D1  1N5822  [V5]
D2  LED  [LED0805]
J24  SIM  [IC-CARD2]
L6  BLM31PG601SN1  [L1206]
Q1  MMBT3904  [SOT23_N]
Q2  MMBT3904  [SOT23_N]
Q3  MMBT3904  [SOT23_N]
R57  3.3K  [R0805]
R58  10K  [R0805]
R64  10K  [R0805]
R68  10K  [R0805]
U3  MC37I  [MC37I]

### Ports
GSM_IGT (in), GSM_OFF (in), USART3_RX2 (out), USART3_TX2 (in)

### Nets
GND: C5.2 C7.1 C8.1 Q1.2(E) Q2.2(E) Q3.2(E) U3.21(GND) U3.22(GND) U3.23(GND) U3.24(GND) U3.25(GND) U3.42(AGND)
GSM_BATT: C5.1 C7.2 C8.2 D1.2(K) D2.1(A) U3.26(BATT+) U3.27(BATT+) U3.28(BATT+) U3.29(BATT+) U3.30(BATT+)
VCC3V3: L6.1
NetC12_1: C12.1 C13.1 C26.1 C28.1 C39.1 J24.4 U3.6(CCGND)
NetC12_2: C12.2 J24.2 U3.4(CCRST)
NetC13_2: C13.2 C39.2 J24.1 J24.7 J24.8 U3.2(CCVCC) U3.5(CCIN)
NetC26_2: C26.2 J24.3 U3.1(CCCLK)
NetC28_2: C28.2 J24.6 U3.3(CCIO)
NetD1_1: D1.1(A) L6.2
NetD2_2: D2.2(K) R57.2
NetQ1_1: Q1.1(B) R58.2
NetQ1_3: Q1.3(C) R57.1
NetQ2_1: Q2.1(B) R64.2
NetQ2_3: Q2.3(C) U3.40(EMERGOFF)
NetQ3_1: Q3.1(B) R68.2
NetQ3_3: Q3.3(C) U3.41(IGT)
NetR58_1: R58.1 U3.13(SYNC)
NetR64_1: R64.1 ; port GSM_IGT
NetR68_1: R68.1 ; port GSM_OFF
NetU3_15: U3.15(RXD0) ; port USART3_TX2
NetU3_17: U3.17(TXD0) ; port USART3_RX2

Not connected (* = marked no-connect by the designer): J24 5; U3 7(RXDDAI) 8(TFSDAI) 9(SCLK) 10(TXDDAI) 11(RFSDAI) 12(BATT_TEMP) 14(RXD1) 16(TXD1) 18(VDDLP) 19(POWER) 20(CHARGE) 31(VDD) 32(RING0) 33(DSR0) 34(RTS0) 35(DTR0) 36(RTS1) 37(CTS0) 38(CTS1) 39(DCD0) 43(MICN1) 44(MICP1) 45(QMICP2) 46(MICN2) 47(EPN1) 48(EPP1) 49(EPP2) 50(EPN2)

### Notes on the sheet
- (near J24) CCVCC
- (near J24) CCRST
- (near J24) CCCLK
- (near J24) CCGND
- (near J24) CCVPP
- CCIO
- (near J24) CCDET1
- (near J24) CCDET2

### Library data of the parts
C5 = Cap Pol1: as C25 on sheet lcd_key_led; Published: 8-Jun-2000; LatestRevisionDate: 17-Jul-2002; LatestRevisionNote: Re-released for DXP Platform.; PackageReference: RB7.6-15; Publisher: Altium Limited
C7 C8 C12 C13 C26 C28 C39 = Cap: Capacitor; Value: 100pF; Published: 8-Jun-2000; LatestRevisionDate: 17-Jul-2002; LatestRevisionNote: Re-released for DXP Platform.; PackageReference: RAD-0.3; Publisher: Altium Limited
D1 = 2JG: Diode
J24 = CON8
L6 = L1
Q1-Q3 = MMBT3904: NPN Switching Transistor; Published: 17-Sep-2003; LatestRevisionDate: 12-Dec-2006; LatestRevisionNote: IPC-7351 Footprint Added.; DatasheetVersion: 13-May-2002; PackageVersion: May-1999; PackageReference: SOT23; Publisher: Altium Limited; PackageDescription: 3-Pin SOT-23 Package 0.95 mm Pitch, 2.3 mm Lead Span; ComponentLink1Description: Manufacturer Link; ComponentLink1URL: http://www.semiconductors.philips.com/; ComponentLink2Description: Datasheet; ComponentLink2URL: http://www.semiconductors.philips.com/acrobat/datasheets/MMBT3904_4.pdf
R57 = Res2: Resistor; Value: 10K; Published: 8-Jun-2000; LatestRevisionDate: 17-Jul-2002; LatestRevisionNote: Re-released for DXP Platform.; PackageReference: AXIAL-0.4; Publisher: Altium Limited
R58 R64 R68 = Res2: Resistor; Published: 8-Jun-2000; LatestRevisionDate: 17-Jul-2002; LatestRevisionNote: Re-released for DXP Platform.; PackageReference: AXIAL-0.4; Publisher: Altium Limited; Value: 10K

## Nets that join several sheets
GND: stm32 (28 pins), EtherNet (18 pins), lcd_key_led (25 pins), POWER (8 pins), GSM (12 pins)
VCC3V3: stm32 (11 pins), EtherNet (11 pins), lcd_key_led (5 pins), POWER (C48.2 C49.2 U10.2), GSM (L6.1)
VCC5V: stm32 (L10.1 L11.1 L12.1 P2.6), lcd_key_led (C21.2 JP1.1 L2.2), POWER (C46.2 C47.2 L3.1 U10.3)
ETH_CS: stm32 (U7.4), EtherNet (U4.9)
ETH_INT: stm32 (U7.2), EtherNet (U4.4)
ETH_RST: stm32 (U7.3), EtherNet (U4.10)
ETH_WOL: stm32 (U7.1), EtherNet (U4.5)
NetC30_1: stm32 (C30.1 U7.12 Y4.2), EtherNet (R1.1)
NetD6_1: stm32 (R8.2 R10.1 U7.37), lcd_key_led (D6.1)
NetP3_3: stm32 (U7.39), lcd_key_led (P3.3 R60.2)
NetP3_4: stm32 (U7.55), lcd_key_led (P3.4 R19.2)
NetP3_5: stm32 (U7.40), lcd_key_led (P3.5 R59.2)
NetP3_6: stm32 (U7.56), lcd_key_led (P3.6 R61.2)
NetP3_7: stm32 (U7.41), lcd_key_led (P3.7 R38.2)
NetP3_8: stm32 (U7.38), lcd_key_led (P3.8 R65.2)
NetP3_9: stm32 (U7.42), lcd_key_led (P3.9 R37.2)
NetP3_11: stm32 (U7.43), lcd_key_led (P3.11 R36.2)
NetP3_13: stm32 (U7.44), lcd_key_led (P3.13 R34.2)
NetP3_15: stm32 (U7.45), lcd_key_led (P3.15 R28.2)
NetP3_17: stm32 (U7.46), lcd_key_led (P3.17 R26.2)
NetP3_18: stm32 (U7.57), lcd_key_led (P3.18 R66.2)
NetP3_19: stm32 (U7.58), lcd_key_led (P3.19 R25.2)
NetP3_20: stm32 (U7.5), lcd_key_led (P3.20 R67.2)
NetP3_29: stm32 (U7.23), lcd_key_led (P3.29)
NetP3_30: stm32 (U7.24), lcd_key_led (P3.30)
NetR3_1: stm32 (U7.70), lcd_key_led (R3.1)
NetR5_1: stm32 (U7.71), lcd_key_led (R5.1)
NetR13_1: stm32 (U7.67), lcd_key_led (R13.1 T2.1)
NetR21_1: stm32 (U7.95), lcd_key_led (R21.1 U5.11)
NetR64_1: stm32 (U7.97), GSM (R64.1)
NetR68_1: stm32 (U7.98), GSM (R68.1)
NetU3_15: stm32 (U7.78), GSM (U3.15)
NetU3_17: stm32 (U7.79), GSM (U3.17)
NetU5_15: stm32 (U7.96), lcd_key_led (U5.15)
SPI_MISO: stm32 (U7.53 U9.2), EtherNet (U4.6), lcd_key_led (U5.12)
SPI_MOSI: stm32 (U7.54 U9.5), EtherNet (U4.7), lcd_key_led (U5.14)
SPI_SCK: stm32 (U7.52 U9.6), EtherNet (U4.8), lcd_key_led (U5.16)